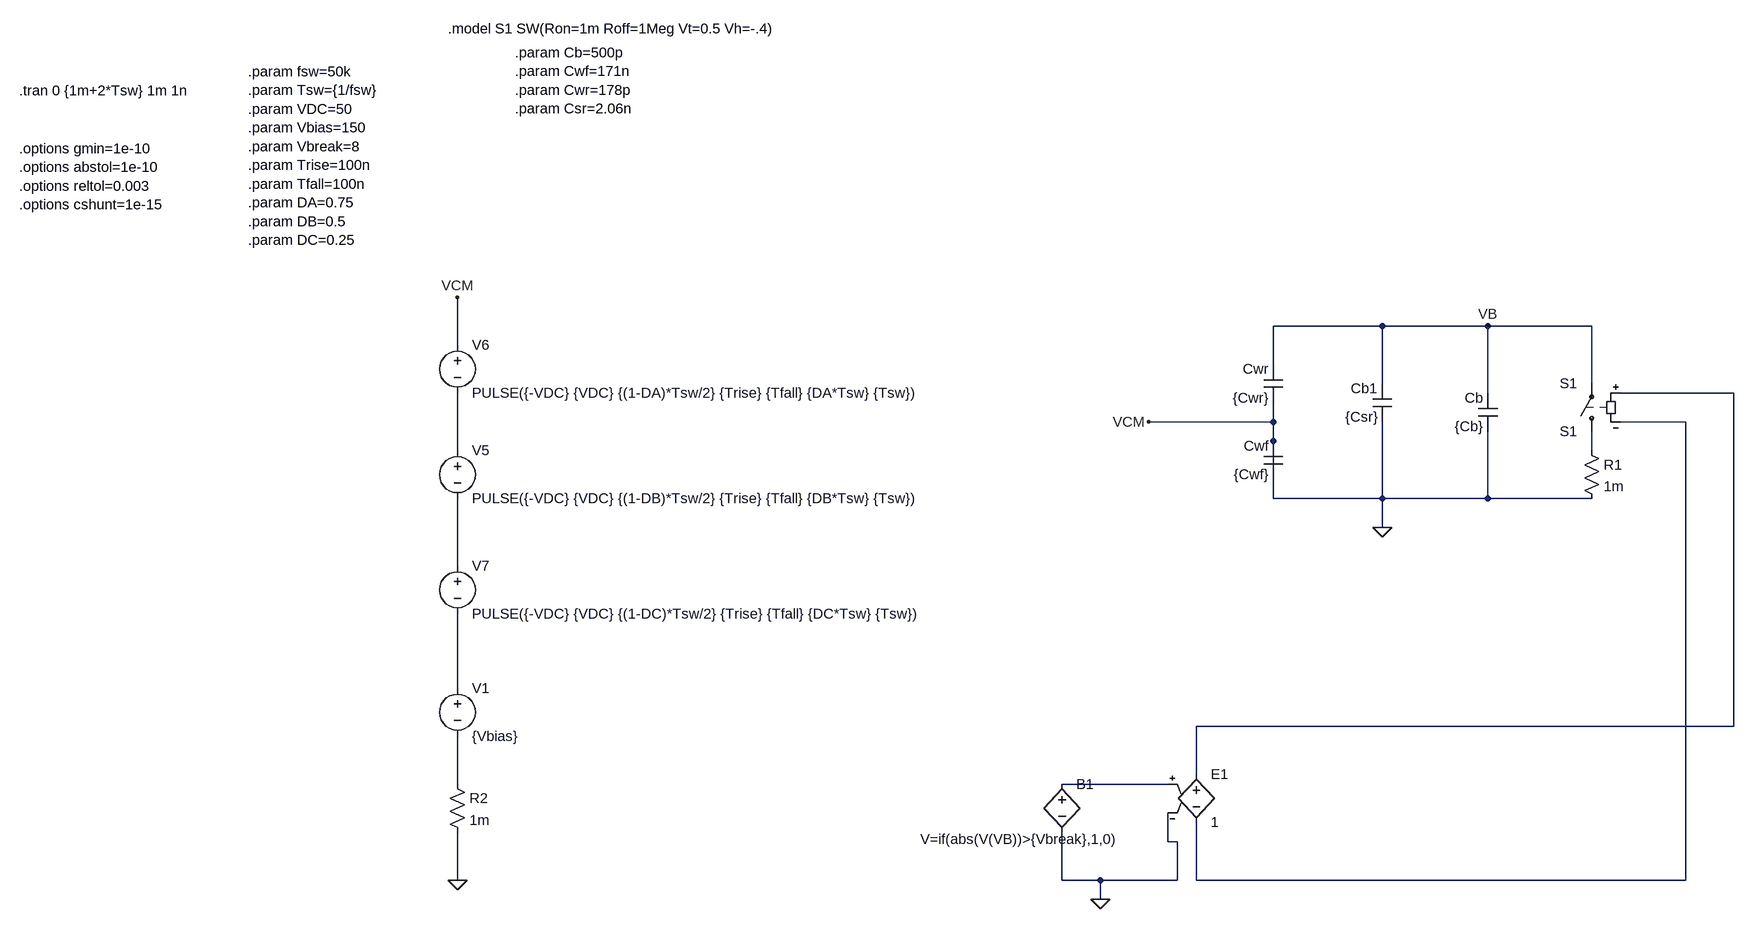
[diagram p0: schematic BearingCurrentModel-Single.asc]
BearingCurrentModel-Single.asc, the LTspice schematic file:
Version 4
SHEET 1 4356 2932
WIRE 496 528 304 528
WIRE 672 528 496 528
WIRE 880 528 672 528
WIRE -1056 560 -1056 480
WIRE 304 592 304 528
WIRE 496 624 496 528
WIRE 880 624 880 528
WIRE 672 640 672 528
WIRE 1152 640 928 640
WIRE 304 688 304 656
WIRE 304 688 96 688
WIRE 1072 688 928 688
WIRE 304 720 304 688
WIRE -1056 736 -1056 640
WIRE 880 736 880 704
WIRE 304 768 304 720
WIRE 304 816 304 784
WIRE 496 816 496 688
WIRE 496 816 304 816
WIRE 672 816 672 704
WIRE 672 816 496 816
WIRE 880 816 672 816
WIRE 496 864 496 816
WIRE -1056 928 -1056 816
WIRE -1056 1152 -1056 1008
WIRE 1152 1216 1152 640
WIRE 1152 1216 176 1216
WIRE 176 1296 176 1216
WIRE -1056 1312 -1056 1232
WIRE 128 1312 -48 1312
WIRE 128 1408 128 1360
WIRE 144 1408 128 1408
WIRE -1056 1472 -1056 1392
WIRE -48 1472 -48 1392
WIRE 16 1472 -48 1472
WIRE 144 1472 144 1408
WIRE 144 1472 16 1472
WIRE 176 1472 176 1376
WIRE 1072 1472 1072 688
WIRE 1072 1472 176 1472
WIRE 16 1504 16 1472
FLAG -1056 480 VCM
FLAG 96 688 VCM
FLAG 496 864 0
FLAG 16 1504 0
FLAG 672 528 VB
FLAG -1056 1472 0
SYMBOL cap 320 656 R180
WINDOW 0 24 56 Left 2
WINDOW 3 24 8 Left 2
SYMATTR InstName Cwr
SYMATTR Value {Cwr}
SYMBOL cap 320 784 R180
WINDOW 0 24 56 Left 2
WINDOW 3 24 8 Left 2
SYMATTR InstName Cwf
SYMATTR Value {Cwf}
SYMBOL cap 688 704 R180
WINDOW 0 24 56 Left 2
WINDOW 3 24 8 Left 2
SYMATTR InstName Cb
SYMATTR Value {Cb}
SYMBOL voltage -1056 720 R0
WINDOW 123 0 0 Left 0
WINDOW 39 0 0 Left 0
SYMATTR InstName V5
SYMATTR Value PULSE({-VDC} {VDC} {(1-DB)*Tsw/2} {Trise} {Tfall} {DB*Tsw} {Tsw})
SYMBOL voltage -1056 544 R0
WINDOW 123 0 0 Left 0
WINDOW 39 0 0 Left 0
SYMATTR InstName V6
SYMATTR Value PULSE({-VDC} {VDC} {(1-DA)*Tsw/2} {Trise} {Tfall} {DA*Tsw} {Tsw})
SYMBOL voltage -1056 912 R0
WINDOW 123 0 0 Left 0
WINDOW 39 0 0 Left 0
SYMATTR InstName V7
SYMATTR Value PULSE({-VDC} {VDC} {(1-DC)*Tsw/2} {Trise} {Tfall} {DC*Tsw} {Tsw})
SYMBOL cap 512 688 R180
WINDOW 0 24 56 Left 2
WINDOW 3 24 8 Left 2
SYMATTR InstName Cb1
SYMATTR Value {Csr}
SYMBOL e 176 1280 R0
SYMATTR InstName E1
SYMATTR Value 1
SYMBOL bv -48 1296 R0
WINDOW 3 -236 108 Left 2
SYMATTR Value V=if(abs(V(VB))>{Vbreak},1,0)
SYMATTR InstName B1
SYMBOL sw 880 720 R180
SYMATTR InstName S1
SYMATTR Value S1
SYMBOL res 864 720 R0
SYMATTR InstName R1
SYMATTR Value 1m
SYMBOL voltage -1056 1136 R0
WINDOW 123 0 0 Left 0
WINDOW 39 0 0 Left 0
SYMATTR InstName V1
SYMATTR Value {Vbias}
SYMBOL res -1072 1296 R0
SYMATTR InstName R2
SYMATTR Value 1m
TEXT -960 72 Left 2 !.param Cb=500p\n.param Cwf=171n\n.param Cwr=178p\n.param Csr=2.06n
TEXT -2120 136 Left 2 !.tran 0 {1m+2*Tsw} 1m 1n
TEXT -2120 232 Left 2 !.options gmin=1e-10   \n.options abstol=1e-10  \n.options reltol=0.003  \n.options cshunt=1e-15
TEXT -1520 104 Left 2 !.param fsw=50k\n.param Tsw={1/fsw}\n.param VDC=50\n.param Vbias=150\n.param Vbreak=8\n.param Trise=100n\n.param Tfall=100n\n.param DA=0.75\n.param DB=0.5\n.param DC=0.25
TEXT -1072 32 Left 2 !.model S1 SW(Ron=1m Roff=1Meg Vt=0.5 Vh=-.4)

The netlist it stands for:
* BearingCurrentModel-Single.asc
Cwr VCM VB {Cwr}
Cwf 0 VCM {Cwf}
Cb 0 VB {Cb}
V5 N003 N005 PULSE({-VDC} {VDC} {(1-DB)*Tsw/2} {Trise} {Tfall} {DB*Tsw} {Tsw})
V6 VCM N003 PULSE({-VDC} {VDC} {(1-DA)*Tsw/2} {Trise} {Tfall} {DA*Tsw} {Tsw})
V7 N005 N006 PULSE({-VDC} {VDC} {(1-DC)*Tsw/2} {Trise} {Tfall} {DC*Tsw} {Tsw})
Cb1 0 VB {Csr}
E1 N001 N002 N008 0 1
B1 N008 0 V=if(abs(V(VB))>{Vbreak},1,0)
S1 N004 VB N001 N002 S1
R1 N004 0 1m
V1 N006 N007 {Vbias}
R2 N007 0 1m
.param Cb=500p
.param Cwf=171n
.param Cwr=178p
.param Csr=2.06n
.tran 0 {1m+2*Tsw} 1m 1n
.options gmin=1e-10
.options abstol=1e-10
.options reltol=0.003
.options cshunt=1e-15
.param fsw=50k
.param Tsw={1/fsw}
.param VDC=50
.param Vbias=150
.param Vbreak=8
.param Trise=100n
.param Tfall=100n
.param DA=0.75
.param DB=0.5
.param DC=0.25
.model S1 SW(Ron=1m Roff=1Meg Vt=0.5 Vh=-.4)
.backanno
.end